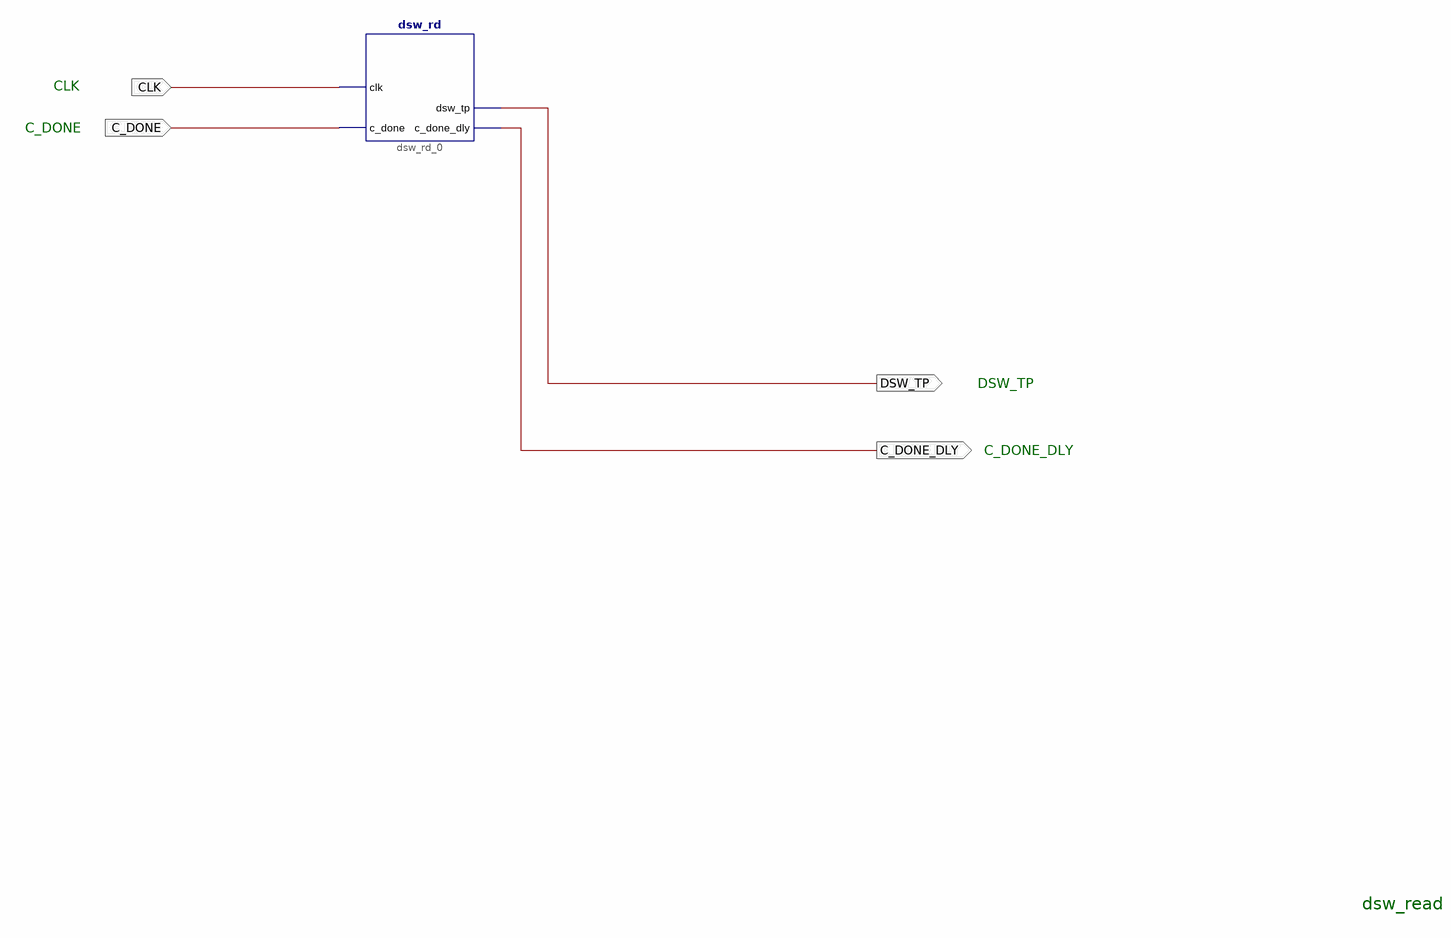
[diagram p0: schematic sheet 1]
// Xilinx ISE schematic dsw_read.sch (aspartan6) as structural Verilog: 1 symbols, 4 ports
module dsw_read (
  input  CLK,
  input  C_DONE,
  output DSW_TP,
  output C_DONE_DLY
);

  dsw_rd dsw_rd_0 (.clk(CLK), .c_done(C_DONE), .dsw_tp(DSW_TP), .c_done_dly(C_DONE_DLY));

  // Notes on the sheet:
  //   CLK
  //   C_DONE
  //   DSW_TP
  //   C_DONE_DLY
  //   dsw_read
endmodule
